# Altium project roneMotorBoard-v12_PlayWorks.PrjPcb
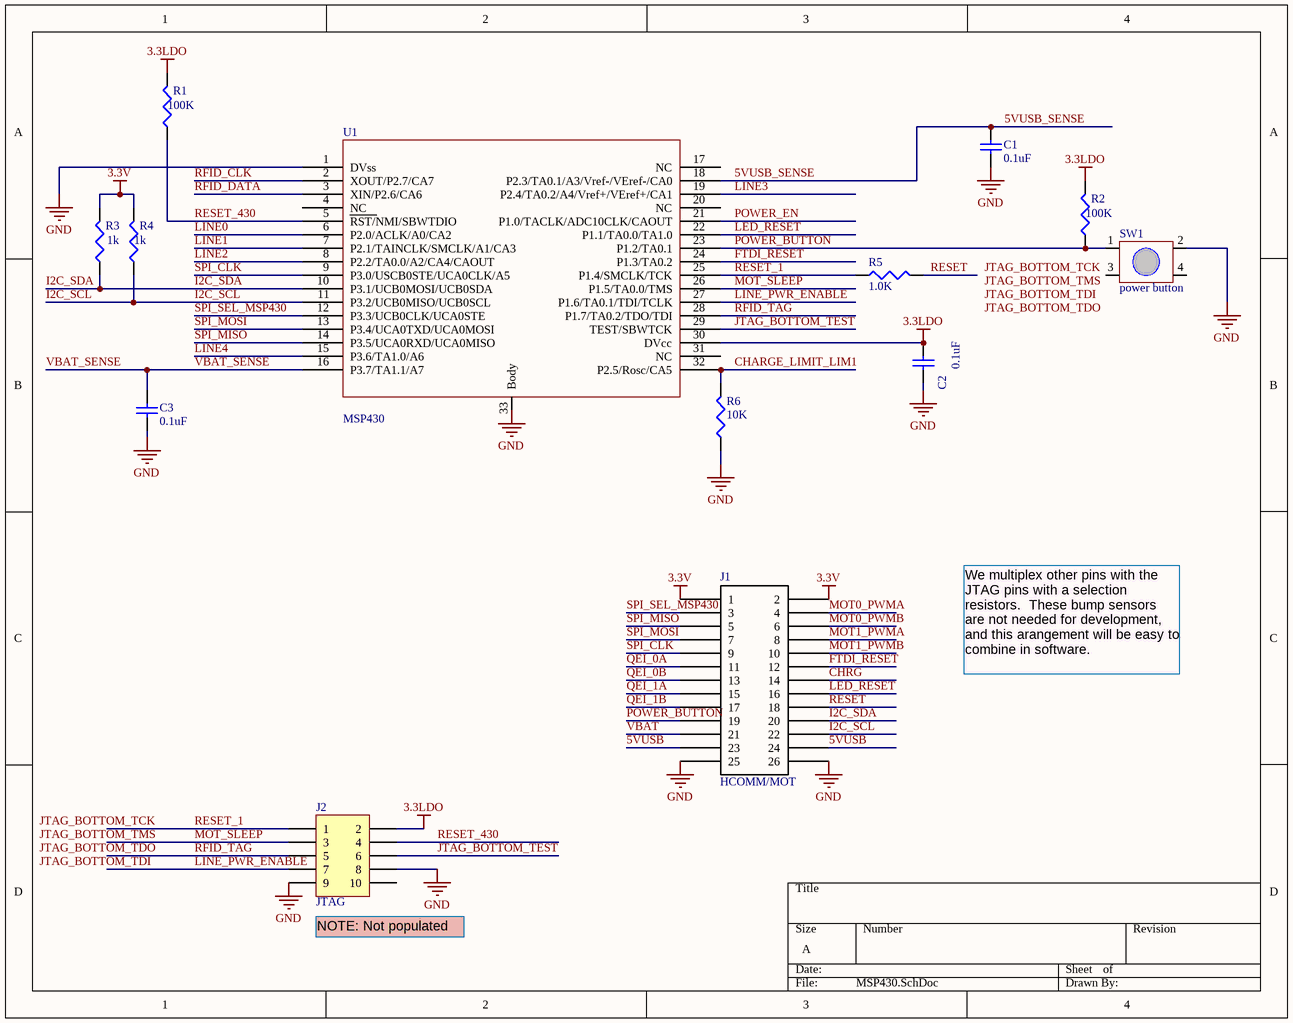
[diagram p0: MSP430.SchDoc]
5 sheets, 102 parts. Net scope: global (net labels, ports and power ports of the same name join across sheets).
Board file: roneMotorBoard-v12_PlayWorks.PcbDoc
Sheets:
  MSP430.SchDoc
  Power.SchDoc
  motorEncoder.SchDoc
  LineSensors.SchDoc
  GyroAccel.SchDoc

## Sheet MSP430.SchDoc
size A; SheetNumber: roneV11-msp430; SheetTotal: 6

### Parts
C1  value 0.1uF  [CAPC1005L]  (hidden comment: Cap Semi)
C2  value 0.1uF  [CAPC1005L]  (hidden comment: Cap Semi)
C3  value 0.1uF  [CAPC1005L]  (hidden comment: Cap Semi)
J1  HCOMM/MOT  [HeaderSM 13x2]
J2  JTAG  [HDR2X5]
R1  value 100K  [RESC1608L]  (hidden comment: Res3)
R2  value 100K  [RESC1608L]  (hidden comment: Res3)
R3  value 1k  [RESC1608L]  (hidden comment: Res3)
R4  value 1k  [RESC1608L]  (hidden comment: Res3)
R5  value 1.0K  [J1-0603]  (hidden comment: Res3)
R6  value 10K  [RESC1608L]  (hidden comment: Res3)
SW1  power button  [SwitchTall-TL330]
U1  MSP430  [MSP430_32PIN]

### Nets
3.3LDO: C2.2 J2.2 R1.2 R2.2 U1.30(DVcc)
3.3V: J1.1 J1.2 R3.2 R4.2
5VUSB: J1.23 J1.24
GND: C1.1 C2.1 C3.1 J1.25 J1.26 J2.8 J2.9 R6.1 SW1.2 U1.1(DVss) U1.33(Body)
VBAT: J1.21
5VUSB_SENSE: C1.2 U1.18(P2.3/TA0.1/A3/Vref-/VEref-/CA0)
CHARGE_LIMIT_LIM1: R6.2 U1.32(P2.5/Rosc/CA5)
CHRG: J1.14
FTDI_RESET: J1.12 U1.24(P1.3/TA0.2)
I2C_SCL: J1.22 R4.1 U1.11(P3.2/UCB0MISO/UCB0SCL)
I2C_SDA: J1.20 R3.1 U1.10(P3.1/UCB0MOSI/UCB0SDA)
JTAG_BOTTOM_TEST: J2.6 U1.29(TEST/SBWTCK)
LED_RESET: J1.16 U1.22(P1.1/TA0.0/TA1.0)
LINE0: U1.6(P2.0/ACLK/A0/CA2)
LINE1: U1.7(P2.1/TAINCLK/SMCLK/A1/CA3)
LINE2: U1.8(P2.2/TA0.0/A2/CA4/CAOUT)
LINE3: U1.19(P2.4/TA0.2/A4/Vref+/VEref+/CA1)
LINE4: U1.15(P3.6/TA1.0/A6)
LINE_PWR_ENABLE: J2.7 U1.27(P1.6/TA0.1/TDI/TCLK)
MOT0_PWMA: J1.4
MOT0_PWMB: J1.6
MOT1_PWMA: J1.8
MOT1_PWMB: J1.10
MOT_SLEEP: J2.3 U1.26(P1.5/TA0.0/TMS)
POWER_BUTTON: J1.19 R2.1 SW1.1 U1.23(P1.2/TA0.1)
POWER_EN: U1.21(P1.0/TACLK/ADC10CLK/CAOUT)
QEI_0A: J1.11
QEI_0B: J1.13
QEI_1A: J1.15
QEI_1B: J1.17
RESET: J1.18 R5.2
RESET_1: J2.1 R5.1 U1.25(P1.4/SMCLK/TCK)
RESET_430: J2.4 R1.1 U1.5(RST/NMI/SBWTDIO)
RFID_CLK: U1.2(XOUT/P2.7/CA7)
RFID_DATA: U1.3(XIN/P2.6/CA6)
RFID_TAG: J2.5 U1.28(P1.7/TA0.2/TDO/TDI)
SPI_CLK: J1.9 U1.9(P3.0/USCB0STE/UCA0CLK/A5)
SPI_MISO: J1.5 U1.14(P3.5/UCA0RXD/UCA0MISO)
SPI_MOSI: J1.7 U1.13(P3.4/UCA0TXD/UCA0MOSI)
SPI_SEL_MSP430: J1.3 U1.12(P3.3/UCB0CLK/UCA0STE)
VBAT_SENSE: C3.2 U1.16(P3.7/TA1.1/A7)

Not connected (* = marked no-connect by the designer): J2 10; SW1 3 4; U1 4(NC) 17(NC) 20(NC) 31(NC)

### Notes on the sheet
- We multiplex other pins with the JTAG pins with a selection resistors.  These bump sensors are not needed for development, and this arangement will be easy to combine in software.
- (near J2) NOTE: Not populated
- Labels drawn without touching a wire or pin: JTAG_BOTTOM_TCK, JTAG_BOTTOM_TDI, JTAG_BOTTOM_TDO, JTAG_BOTTOM_TMS

### Library data of the parts
C1-C3 = Cap Semi: Capacitor (Semiconductor SIM Model); Published: 8-Jun-2000; LatestRevisionDate: 29-May-2009; LatestRevisionNote: IPC-7351 Footprint Added.; PackageReference: C1206; Publisher: Altium Limited; PackageDescription: Chip Capacitor
J1 = HCOMM/HMOT: Header, 2X20, 50mil, IDC
J2 = Header 5X2: Header, 5-Pin, Dual row; LatestRevisionDate: 17-Jul-2002; LatestRevisionNote: Re-released for DXP Platform.; Publisher: Altium Limited
R1-R6 = Res3: Resistor; Published: 8-Jun-2000; LatestRevisionDate: 29-May-2009; LatestRevisionNote: IPC-7351 Footprint Added.; PackageReference: J1-0603; Publisher: Altium Limited; PackageDescription: Chip Resistor
SW1 = Switch-TL330
U1 = MSP430_32pin

## Sheet Power.SchDoc
size A; SheetNumber: roneV11-Power; SheetTotal: 6
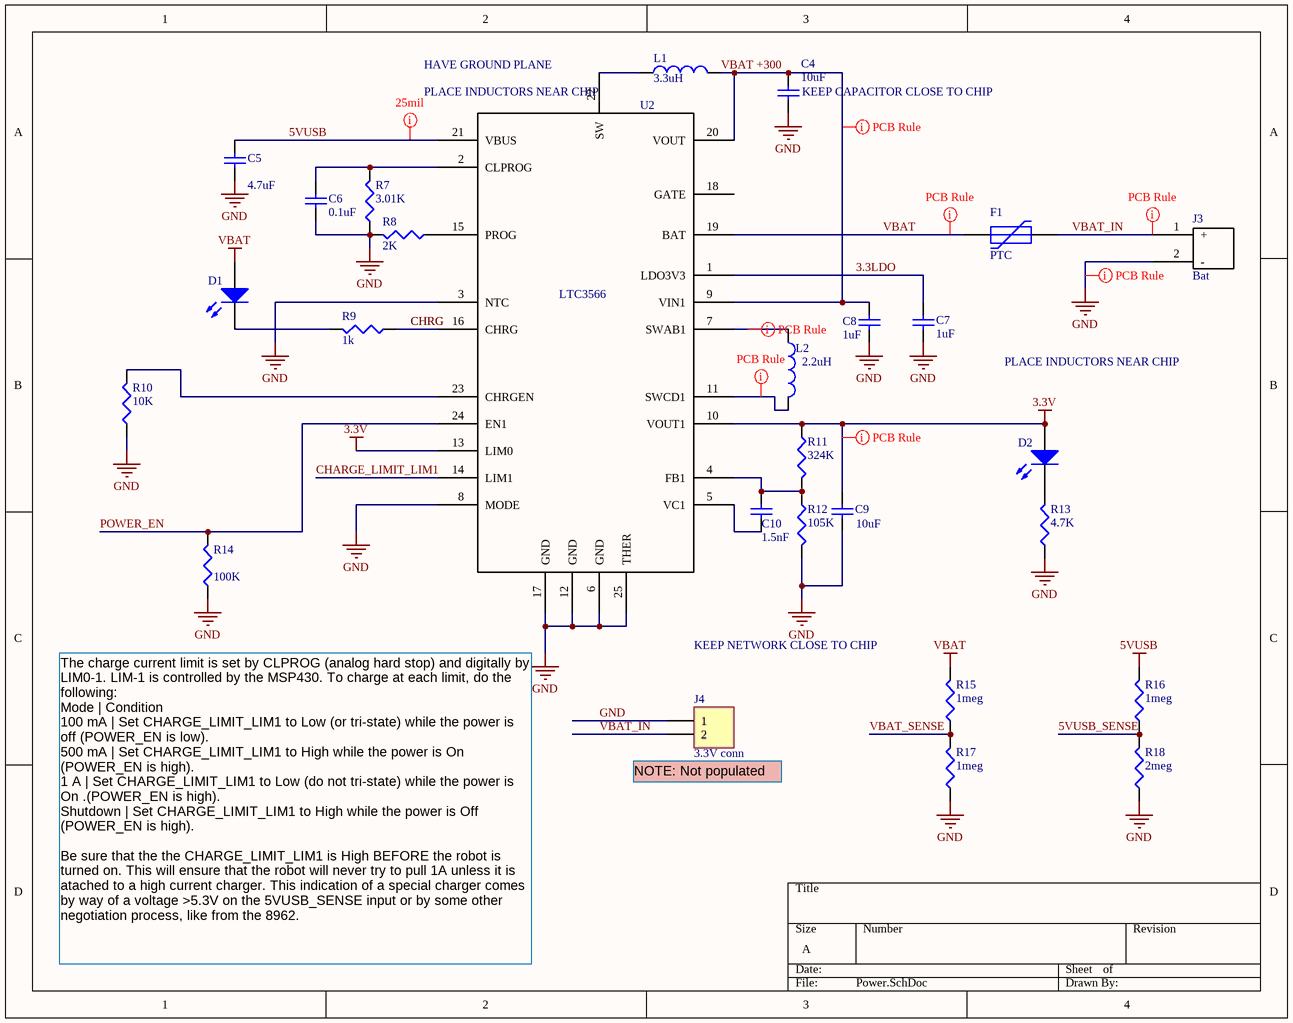
[diagram p1: Power.SchDoc]

### Parts
C4  value 10uF  [CAPC1608L]  (hidden comment: Cap)
C5  value 4.7uF  [CAPC1608L]  (hidden comment: Cap Semi)
C6  value 0.1uF  [CAPC1005L]  (hidden comment: Cap)
C7  value 1uF  [CAPC1608L]  (hidden comment: Cap)
C8  value 1uF  [CAPC1608L]  (hidden comment: Cap)
C9  value 10uF  [CAPC1608L]  (hidden comment: Cap)
C10  value 1.5nF  [CAPC1005L]  (hidden comment: Cap)
D1  Charge  [INDC2012L]  (value not drawn)
D2  Power  [INDC2012L]  (value not drawn)
F1  PTC  [ERJ8G-1206]
J3  Bat  [BatteryConnJST]
J4  3.3V conn  [HDR1X2]
L1  3.3uH  [IndPow]
L2  2.2uH  [IndPow]
R7  value 3.01K  [RESC1608L]  (hidden comment: Res3)
R8  value 2K  [RESC1608L]  (hidden comment: Res3)
R9  value 1k  [RESC1608L]  (hidden comment: Res3)
R10  value 10K  [RESC1608L]  (hidden comment: Res3)
R11  value 324K  [RESC1608L]  (hidden comment: Res3)
R12  value 105K  [RESC1608L]  (hidden comment: Res3)
R13  value 4.7K  [RESC1608L]  (hidden comment: Res3)
R14  value 100K  [RESC1608L]  (hidden comment: Res3)
R15  value 1meg  [RESC1608L]  (hidden comment: Res3)
R16  value 1meg  [RESC1608L]  (hidden comment: Res3)
R17  value 1meg  [RESC1608L]  (hidden comment: Res3)
R18  value 2meg  [RESC1608L]  (hidden comment: Res3)
U2  LTC3566  [QFN-24]

### Nets
3.3LDO: C7.1 U2.1(LDO3V3)
3.3V: C9.2 D2.1(A) R11.1 U2.10(VOUT1) U2.13(LIM0)
5VUSB: C5.2 R16.2 U2.21(VBUS)
GND: C4.1 C5.1 C6.1 C7.2 C8.2 C9.1 J3.2(-) J4.1 R7.1 R8.2 R10.1 R12.2 R13.1 R14.1 R17.1 R18.1 U2.3(NTC) U2.6(GND) U2.8(MODE) U2.12(GND) U2.17(GND) U2.25(THER)
VBAT: D1.1(A) F1.1 R15.2 U2.19(BAT)
5VUSB_SENSE: R16.1 R18.2
CHARGE_LIMIT_LIM1: U2.14(LIM1)
CHRG: R9.1 U2.16(CHRG)
POWER_EN: R14.2 U2.24(EN1)
VBAT +300: C4.2 C8.1 L1.2 U2.9(VIN1) U2.20(VOUT)
VBAT_IN: F1.2 J3.1(+) J4.2
VBAT_SENSE: R15.1 R17.2
NetC6_2: C6.2 R7.2 U2.2(CLPROG)
NetC10_1: C10.1 R11.2 R12.1 U2.4(FB1)
NetC10_2: C10.2 U2.5(VC1)
NetD1_2: D1.2(K) R9.2
NetD2_2: D2.2(K) R13.2
NetL1_1: L1.1 U2.22(SW)
NetL2_1: L2.1 U2.7(SWAB1)
NetL2_2: L2.2 U2.11(SWCD1)
NetR8_1: R8.1 U2.15(PROG)
NetR10_2: R10.2 U2.23(CHRGEN)

Not connected (* = marked no-connect by the designer): U2 18(GATE)

### Layout directives
rule Width Constraint [Pref Width = 25mil    Min Width = 10mil    Max Width = 25mil]: 5VUSB, GND, NetL2_1, NetL2_2, VBAT +300, VBAT_IN
rule Width Constraint [Pref Width = 25mil    Min Width = 10mil    Max Width = 100mil]: 3.3V
rule Width Constraint [Pref Width = 25mil    Min Width = 10mil    Max Width = 50mil]: VBAT

### Notes on the sheet
- (near U2) HAVE GROUND PLANE
- (near U2) PLACE INDUCTORS NEAR CHIP
- (near C4) KEEP CAPACITOR CLOSE TO CHIP
- CHRG
- PLACE INDUCTORS NEAR CHIP
- KEEP NETWORK CLOSE TO CHIP
- (near J4) NOTE: Not populated
- The charge current limit is set by CLPROG (analog hard stop) and digitally by LIM0-1. LIM-1 is controlled by the MSP430. To charge at each limit, do the following:
  Mode	| Condition
  100 mA	| Set CHARGE_LIMIT_LIM1 to Low (or tri-state) while the power is off (POWER_EN is low).
  500 mA	| Set CHARGE_LIMIT_LIM1 to High while the power is On (POWER_EN is high).
  1 A	| Set CHARGE_LIMIT_LIM1 to Low (do not tri-state) while the power is On .(POWER_EN is high).
  Shutdown | Set CHARGE_LIMIT_LIM1 to High while the power is Off (POWER_EN is high).
  Be sure that the the CHARGE_LIMIT_LIM1 is High BEFORE the robot is turned on. This will ensure that the robot will never try to pull 1A unless it is atached to a high current charger. This indication of a special charger comes by way of a voltage >5.3V on the 5VUSB_SENSE input or by some other negotiation process, like from the 8962.

### Library data of the parts
C4 C6-C10 = Cap: Capacitor; Published: 8-Jun-2000; LatestRevisionDate: 17-Jul-2002; LatestRevisionNote: Re-released for DXP Platform.; PackageReference: RAD-0.3; Publisher: Altium Limited
C5 = Cap Semi: Capacitor (Semiconductor SIM Model); Published: 8-Jun-2000; LatestRevisionDate: 29-May-2009; LatestRevisionNote: IPC-7351 Footprint Added.; PackageReference: C1206; Publisher: Altium Limited; PackageDescription: Chip Capacitor
D1 D2 = LED2: Typical RED, GREEN, YELLOW, AMBER GaAs LED; Published: 8-Jun-2000; LatestRevisionDate: 17-Jul-2002; LatestRevisionNote: Re-released for DXP Platform.; PackageVersion: Feb-2002; PackageReference: 3.2X1.6X1.1; Publisher: Altium Limited
F1 = PTC_FUSE: Fuse; Published: 8-Jun-2000; LatestRevisionDate: 17-Jul-2002; LatestRevisionNote: Re-released for DXP Platform.; PackageReference: PIN-W2/E2.8; Publisher: Altium Limited
J3 = BatteryConnJST
J4 = Header 2: Header, 2-Pin; LatestRevisionDate: 17-Jul-2002; LatestRevisionNote: Re-released for DXP Platform.; Publisher: Altium Limited
L1 L2 = Inductor
  L1: Value: 3.3uH
  L2: Value: 2.2uH
R7-R18 = Res3: Resistor; Published: 8-Jun-2000; LatestRevisionDate: 29-May-2009; LatestRevisionNote: IPC-7351 Footprint Added.; PackageReference: J1-0603; Publisher: Altium Limited; PackageDescription: Chip Resistor

## Sheet motorEncoder.SchDoc: r-one Motor
size A; Date: 08/09/2011; DrawnBy: MRSL; Engineer: MRSL; Organization: Rice University; Revision: V11; SheetNumber: roneV11-motorEncoder; SheetTotal: 6; DocumentName: RoneV11-motorEncoder
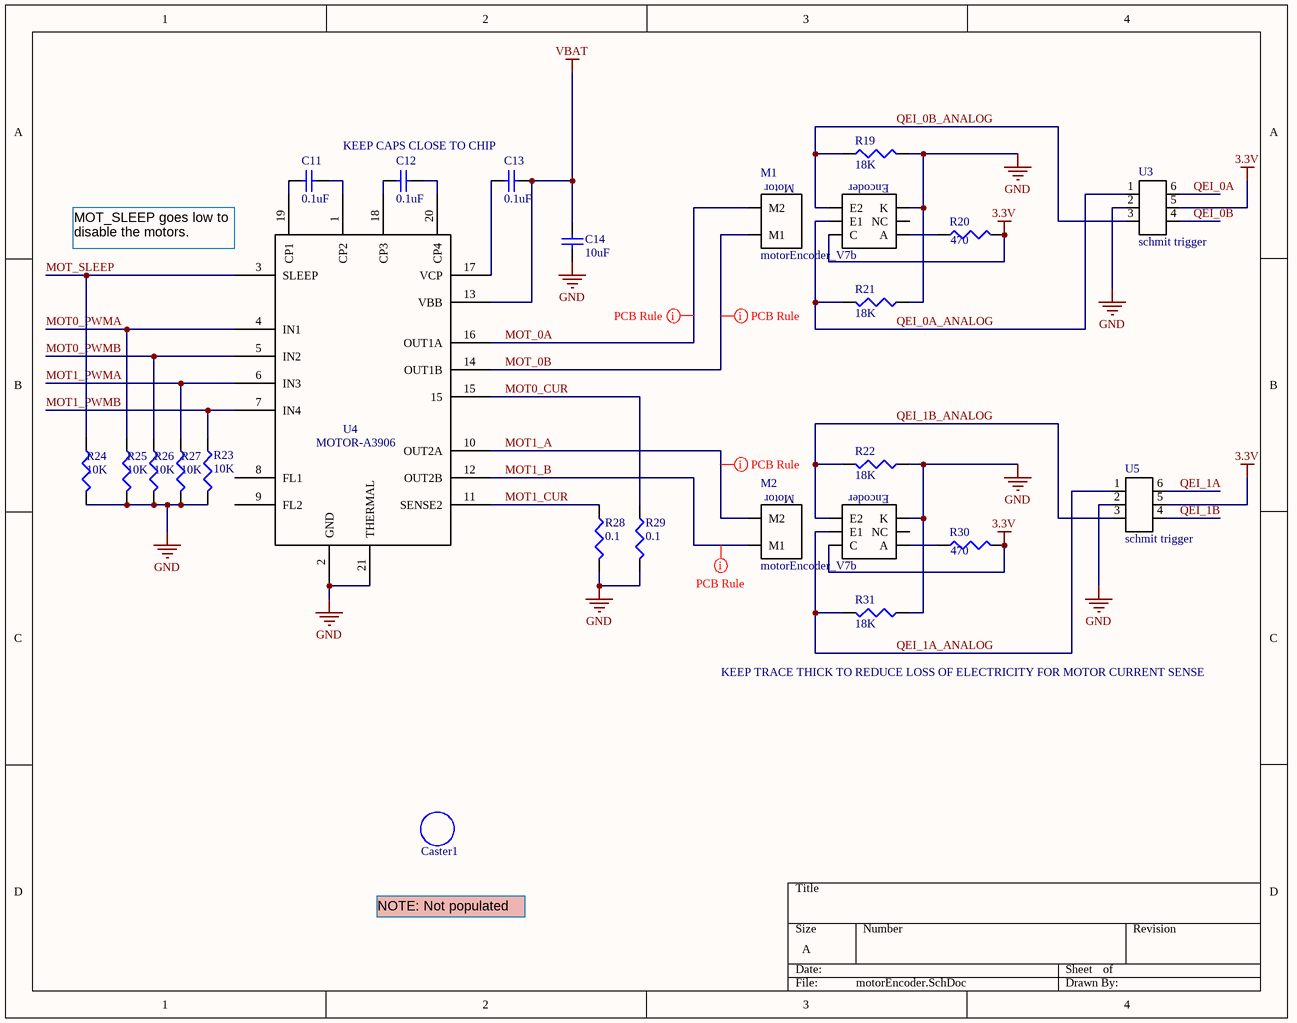
[diagram p2: motorEncoder.SchDoc]

### Parts
C11  value 0.1uF  [CAPC1005L]  (hidden comment: Cap Semi)
C12  value 0.1uF  [CAPC1005L]  (hidden comment: Cap Semi)
C13  value 0.1uF  [CAPC1005L]  (hidden comment: Cap Semi)
C14  value 10uF  [CAPC1608L]  (hidden comment: Cap Semi)
Caster1  non connect  [3/4"CASTER2]  (value not drawn)
M1  motorEncoder_V7b  [motorEncoder_V7b]
M2  motorEncoder_V7b  [motorEncoder_V7b]
R19  value 18K  [RESC1608L]
R20  value 470  [RESC1608L]
R21  value 18K  [RESC1608L]
R22  value 18K  [RESC1608L]
R23  value 10K  [RESC1608L]  (hidden comment: Res3)
R24  value 10K  [CAPC1608L]  (hidden comment: Res3)
R25  value 10K  [RESC1608L]  (hidden comment: Res3)
R26  value 10K  [RESC1608L]  (hidden comment: Res3)
R27  value 10K  [RESC1608L]  (hidden comment: Res3)
R28  value 0.1  [RESC1608L]  (hidden comment: Res3)
R29  value 0.1  [RESC1608L]  (hidden comment: Res3)
R30  value 470  [RESC1608L]
R31  value 18K  [RESC1608L]
U3  schmit trigger  [DCK(R-PDSO-C6)]
U4  MOTOR-A3906  [QFN-20]
U5  schmit trigger  [DCK(R-PDSO-C6)]

### Nets
3.3V: M1.C M2.C R20.2 R30.2 U3.5 U5.5
GND: C14.1 M1.K M2.K R19.2 R21.1 R22.1 R23.2 R24.2 R25.2 R26.2 R27.2 R28.2 R29.2 R31.1 U3.2 U4.2(GND) U4.21(THERMAL) U5.2
VBAT: C13.1 C14.2 U4.13(VBB)
MOT0_CUR: R29.1 U4.15
MOT0_PWMA: R25.1 U4.4(IN1)
MOT0_PWMB: R26.1 U4.5(IN2)
MOT1_A: M2.M2 U4.10(OUT2A)
MOT1_B: M2.M1 U4.12(OUT2B)
MOT1_CUR: R28.1 U4.11(SENSE2)
MOT1_PWMA: R27.1 U4.6(IN3)
MOT1_PWMB: R23.1 U4.7(IN4)
MOT_0A: M1.M2 U4.16(OUT1A)
MOT_0B: M1.M1 U4.14(OUT1B)
MOT_SLEEP: R24.1 U4.3(SLEEP)
QEI_0A: U3.6
QEI_0A_ANALOG: M1.E1 R21.2 U3.1
QEI_0B: U3.4
QEI_0B_ANALOG: M1.E2 R19.1 U3.3
QEI_1A: U5.6
QEI_1A_ANALOG: M2.E1 R31.2 U5.1
QEI_1B: U5.4
QEI_1B_ANALOG: M2.E2 R22.2 U5.3
NetC11_1: C11.1 U4.19(CP1)
NetC11_2: C11.2 U4.1(CP2)
NetC12_1: C12.1 U4.18(CP3)
NetC12_2: C12.2 U4.20(CP4)
NetC13_2: C13.2 U4.17(VCP)
NetM1_A: M1.A R20.1
NetM2_A: M2.A R30.1

Not connected (* = marked no-connect by the designer): M1 NC; M2 NC; U4 8(FL1) 9(FL2)

### Layout directives
rule Width Constraint [Pref Width = 20mil    Min Width = 10mil    Max Width = 25mil]: MOT1_A, MOT1_B, MOT_0A, MOT_0B

### Notes on the sheet
- KEEP CAPS CLOSE TO CHIP
- (near U4) MOT_SLEEP goes low to disable the motors.
- KEEP TRACE THICK TO REDUCE LOSS OF ELECTRICITY FOR MOTOR CURRENT SENSE
- NOTE: Not populated
- (in symbol motorEncoder_V7b) Motor; Encoder

### Library data of the parts
C11-C14 = Cap Semi: Capacitor (Semiconductor SIM Model); Published: 8-Jun-2000; LatestRevisionDate: 29-May-2009; LatestRevisionNote: IPC-7351 Footprint Added.; PackageReference: C1206; Publisher: Altium Limited; PackageDescription: Chip Capacitor
Caster1 = Caster 3/4in: This is just a space saver to get the caster onto the pcb
R19-R31 = Res3: Resistor; Published: 8-Jun-2000; LatestRevisionDate: 29-May-2009; LatestRevisionNote: IPC-7351 Footprint Added.; PackageReference: J1-0603; Publisher: Altium Limited; PackageDescription: Chip Resistor

## Sheet LineSensors.SchDoc
size A; SheetNumber: roneV11-GyroAccel; SheetTotal: 6
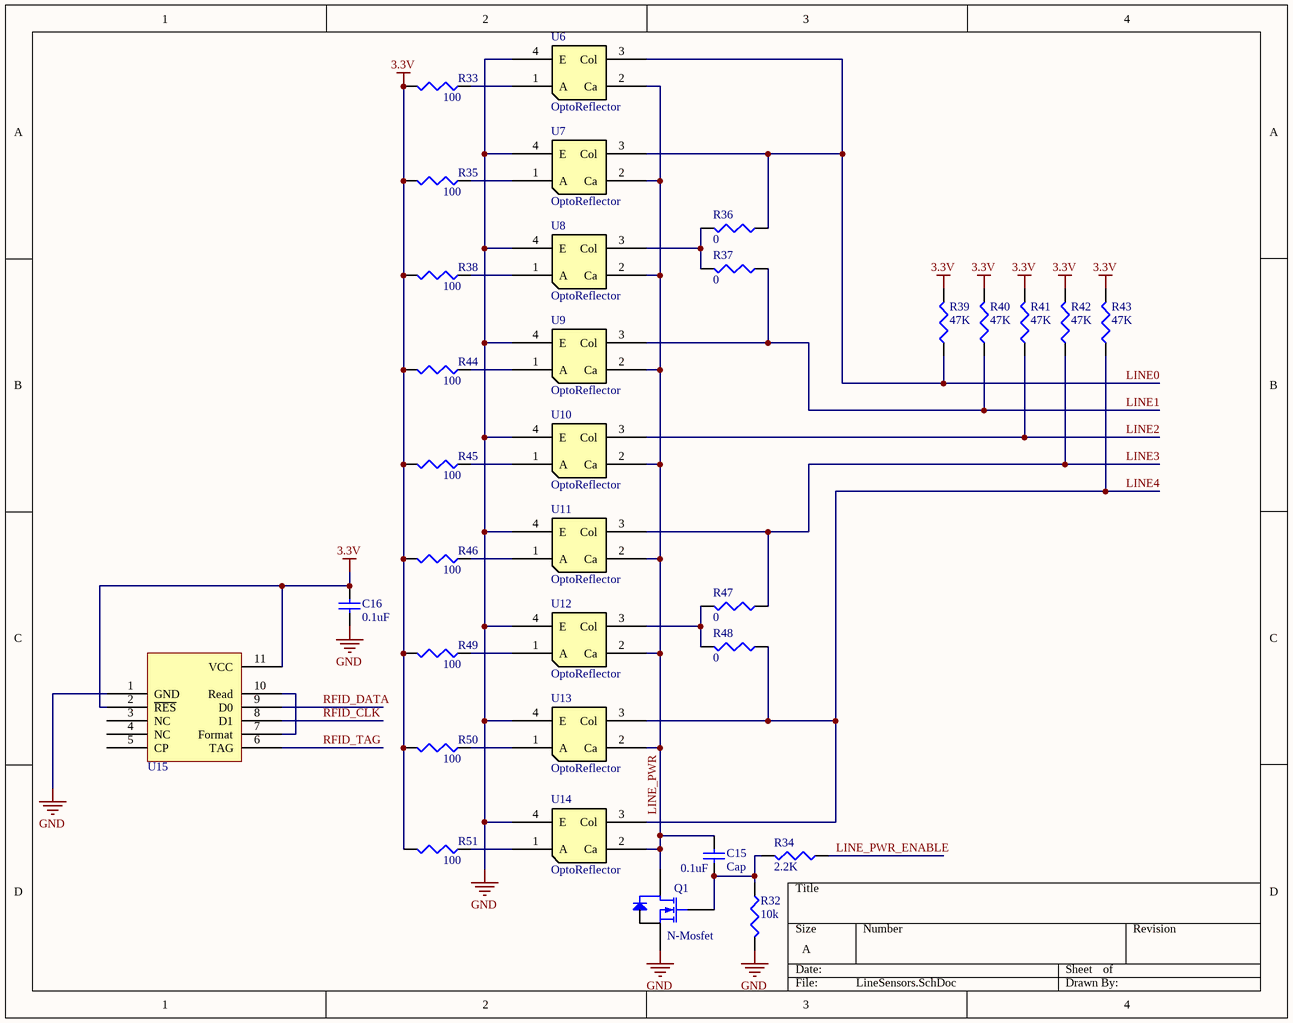
[diagram p3: LineSensors.SchDoc]

### Parts
C15  Cap  value 0.1uF  [CAPC1005L]
C16  value 0.1uF  [CAPC1005L]  (hidden comment: Cap Semi)
Q1  N-Mosfet  [SOT-23]
R32  value 10k  [J1-0603]  (hidden comment: Res3)
R33  value 100  [J1-0603]  (hidden comment: Res3)
R34  value 2.2K  [J1-0603]  (hidden comment: Res3)
R35  value 100  [J1-0603]  (hidden comment: Res3)
R36  value 0  [J1-0603]  (hidden comment: Res3)
R37  value 0  [J1-0603]  (hidden comment: Res3)
R38  value 100  [J1-0603]  (hidden comment: Res3)
R39  value 47K  [J1-0603]  (hidden comment: Res3)
R40  value 47K  [J1-0603]  (hidden comment: Res3)
R41  value 47K  [J1-0603]  (hidden comment: Res3)
R42  value 47K  [J1-0603]  (hidden comment: Res3)
R43  value 47K  [J1-0603]  (hidden comment: Res3)
R44  value 100  [J1-0603]  (hidden comment: Res3)
R45  value 100  [J1-0603]  (hidden comment: Res3)
R46  value 100  [J1-0603]  (hidden comment: Res3)
R47  value 0  [J1-0603]  (hidden comment: Res3)
R48  value 0  [J1-0603]  (hidden comment: Res3)
R49  value 100  [J1-0603]  (hidden comment: Res3)
R50  value 100  [J1-0603]  (hidden comment: Res3)
R51  value 100  [J1-0603]  (hidden comment: Res3)
U6  OptoReflector  [QRE1113]
U7  OptoReflector  [QRE1113]
U8  OptoReflector  [QRE1113]
U9  OptoReflector  [QRE1113]
U10  OptoReflector  [QRE1113]
U11  OptoReflector  [QRE1113]
U12  OptoReflector  [QRE1113]
U13  OptoReflector  [QRE1113]
U14  OptoReflector  [QRE1113]
U15  ID-12LA  [ID12-LA]  (value not drawn)

### Nets
3.3V: C16.2 R33.2 R35.2 R38.2 R39.2 R40.2 R41.2 R42.2 R43.2 R44.2 R45.2 R46.2 R49.2 R50.2 R51.2 U15.2(~{RES}) U15.11(VCC)
GND: C16.1 Q1.2(S) R32.1 U6.4(E) U7.4(E) U8.4(E) U9.4(E) U10.4(E) U11.4(E) U12.4(E) U13.4(E) U14.4(E) U15.1(GND)
LINE0: R36.1 R39.1 U6.3(Col) U7.3(Col)
LINE1: R37.1 R40.1 U9.3(Col)
LINE2: R41.1 U10.3(Col)
LINE3: R42.1 R47.1 U11.3(Col)
LINE4: R43.1 R48.1 U13.3(Col) U14.3(Col)
LINE_PWR: C15.1 Q1.3(D) U6.2(Ca) U7.2(Ca) U8.2(Ca) U9.2(Ca) U10.2(Ca) U11.2(Ca) U12.2(Ca) U13.2(Ca) U14.2(Ca)
LINE_PWR_ENABLE: R34.2
RFID_CLK: U15.8(D1)
RFID_DATA: U15.9(D0)
RFID_TAG: U15.6(TAG)
NetC15_2: C15.2 Q1.1(G) R32.2 R34.1
NetR33_1: R33.1 U6.1(A)
NetR35_1: R35.1 U7.1(A)
NetR36_2: R36.2 R37.2 U8.3(Col)
NetR38_1: R38.1 U8.1(A)
NetR44_1: R44.1 U9.1(A)
NetR45_1: R45.1 U10.1(A)
NetR46_1: R46.1 U11.1(A)
NetR47_2: R47.2 R48.2 U12.3(Col)
NetR49_1: R49.1 U12.1(A)
NetR50_1: R50.1 U13.1(A)
NetR51_1: R51.1 U14.1(A)
NetU15_7: U15.7(Format) U15.10(Read)

Not connected (* = marked no-connect by the designer): U15 3(NC) 4(NC) 5(CP)

### Library data of the parts
C15 = Cap: Capacitor; Published: 8-Jun-2000; LatestRevisionDate: 17-Jul-2002; LatestRevisionNote: Re-released for DXP Platform.; PackageReference: RAD-0.3; Publisher: Altium Limited
C16 = Cap Semi: Capacitor (Semiconductor SIM Model); Published: 8-Jun-2000; LatestRevisionDate: 29-May-2009; LatestRevisionNote: IPC-7351 Footprint Added.; PackageReference: C1206; Publisher: Altium Limited; PackageDescription: Chip Capacitor
R32-R51 = Res3: Resistor; Published: 8-Jun-2000; LatestRevisionDate: 29-May-2009; LatestRevisionNote: IPC-7351 Footprint Added.; PackageReference: J1-0603; Publisher: Altium Limited; PackageDescription: Chip Resistor
U6-U14 = QRE1113GR

## Sheet GyroAccel.SchDoc
size A; SheetNumber: roneV11-GyroAccel; SheetTotal: 6
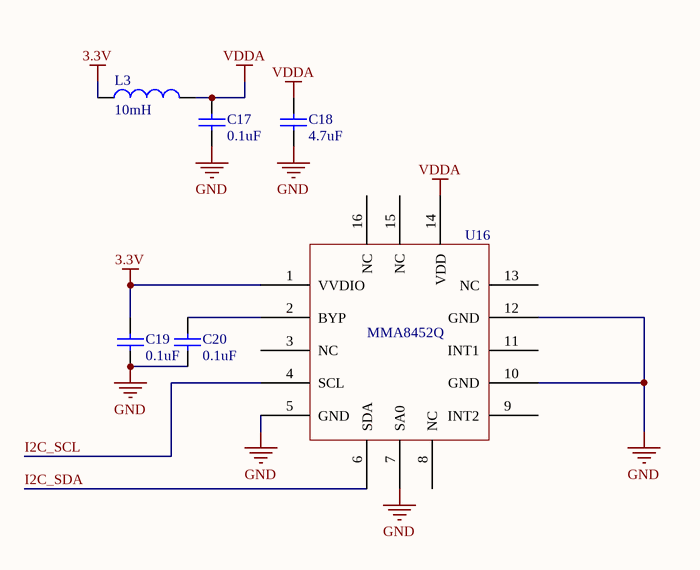
[diagram p4: GyroAccel.SchDoc]

### Parts
C17  value 0.1uF  [CAPC1005L]  (hidden comment: Cap Semi)
C18  value 4.7uF  [CAPC1608L]  (hidden comment: Cap Semi)
C19  value 0.1uF  [CAPC1005L]  (hidden comment: Cap Semi)
C20  value 0.1uF  [CAPC1005L]  (hidden comment: Cap Semi)
L3  value 10mH  [INDC2012L]  (hidden comment: Inductor)
U16  MMA8452Q  [MMA8452Q]

### Nets
3.3V: C19.2 L3.2 U16.1(VVDIO)
GND: C17.1 C18.1 C19.1 C20.1 U16.5(GND) U16.7(SA0) U16.10(GND) U16.12(GND)
VDDA: C17.2 C18.2 L3.1 U16.14(VDD)
I2C_SCL: U16.4(SCL)
I2C_SDA: U16.6(SDA)
NetC20_2: C20.2 U16.2(BYP)

Not connected (* = marked no-connect by the designer): U16 3(NC) 8(NC) 9(INT2) 11(INT1) 13(NC) 15(NC) 16(NC)

### Library data of the parts
C17-C20 = Cap Semi: Capacitor (Semiconductor SIM Model); Published: 8-Jun-2000; LatestRevisionDate: 29-May-2009; LatestRevisionNote: IPC-7351 Footprint Added.; PackageReference: C1206; Publisher: Altium Limited; PackageDescription: Chip Capacitor
L3 = Inductor: Code_IEC: 1005; Published: 8-Jun-2000; LatestRevisionDate: 29-May-2009; LatestRevisionNote: IPC-7351 Footprint Added.; PackageReference: 0402-A; Publisher: Altium Limited; PackageDescription: Chip Inductor; Code_JEITA: 0402

## Nets that join several sheets
3.3LDO: MSP430 (5 pins), Power (C7.1 U2.1)
3.3V: MSP430 (J1.1 J1.2 R3.2 R4.2), Power (5 pins), motorEncoder (6 pins), LineSensors (17 pins), GyroAccel (C19.2 L3.2 U16.1)
5VUSB: MSP430 (J1.23 J1.24), Power (C5.2 R16.2 U2.21)
GND: MSP430 (11 pins), Power (22 pins), motorEncoder (18 pins), LineSensors (13 pins), GyroAccel (8 pins)
VBAT: MSP430 (J1.21), Power (D1.1 F1.1 R15.2 U2.19), motorEncoder (C13.1 C14.2 U4.13)
5VUSB_SENSE: MSP430 (C1.2 U1.18), Power (R16.1 R18.2)
CHARGE_LIMIT_LIM1: MSP430 (R6.2 U1.32), Power (U2.14)
CHRG: MSP430 (J1.14), Power (R9.1 U2.16)
I2C_SCL: MSP430 (J1.22 R4.1 U1.11), GyroAccel (U16.4)
I2C_SDA: MSP430 (J1.20 R3.1 U1.10), GyroAccel (U16.6)
LINE0: MSP430 (U1.6), LineSensors (R36.1 R39.1 U6.3 U7.3)
LINE1: MSP430 (U1.7), LineSensors (R37.1 R40.1 U9.3)
LINE2: MSP430 (U1.8), LineSensors (R41.1 U10.3)
LINE3: MSP430 (U1.19), LineSensors (R42.1 R47.1 U11.3)
LINE4: MSP430 (U1.15), LineSensors (R43.1 R48.1 U13.3 U14.3)
LINE_PWR_ENABLE: MSP430 (J2.7 U1.27), LineSensors (R34.2)
MOT0_PWMA: MSP430 (J1.4), motorEncoder (R25.1 U4.4)
MOT0_PWMB: MSP430 (J1.6), motorEncoder (R26.1 U4.5)
MOT1_PWMA: MSP430 (J1.8), motorEncoder (R27.1 U4.6)
MOT1_PWMB: MSP430 (J1.10), motorEncoder (R23.1 U4.7)
MOT_SLEEP: MSP430 (J2.3 U1.26), motorEncoder (R24.1 U4.3)
POWER_EN: MSP430 (U1.21), Power (R14.2 U2.24)
QEI_0A: MSP430 (J1.11), motorEncoder (U3.6)
QEI_0B: MSP430 (J1.13), motorEncoder (U3.4)
QEI_1A: MSP430 (J1.15), motorEncoder (U5.6)
QEI_1B: MSP430 (J1.17), motorEncoder (U5.4)
RFID_CLK: MSP430 (U1.2), LineSensors (U15.8)
RFID_DATA: MSP430 (U1.3), LineSensors (U15.9)
RFID_TAG: MSP430 (J2.5 U1.28), LineSensors (U15.6)
VBAT_SENSE: MSP430 (C3.2 U1.16), Power (R15.1 R17.2)